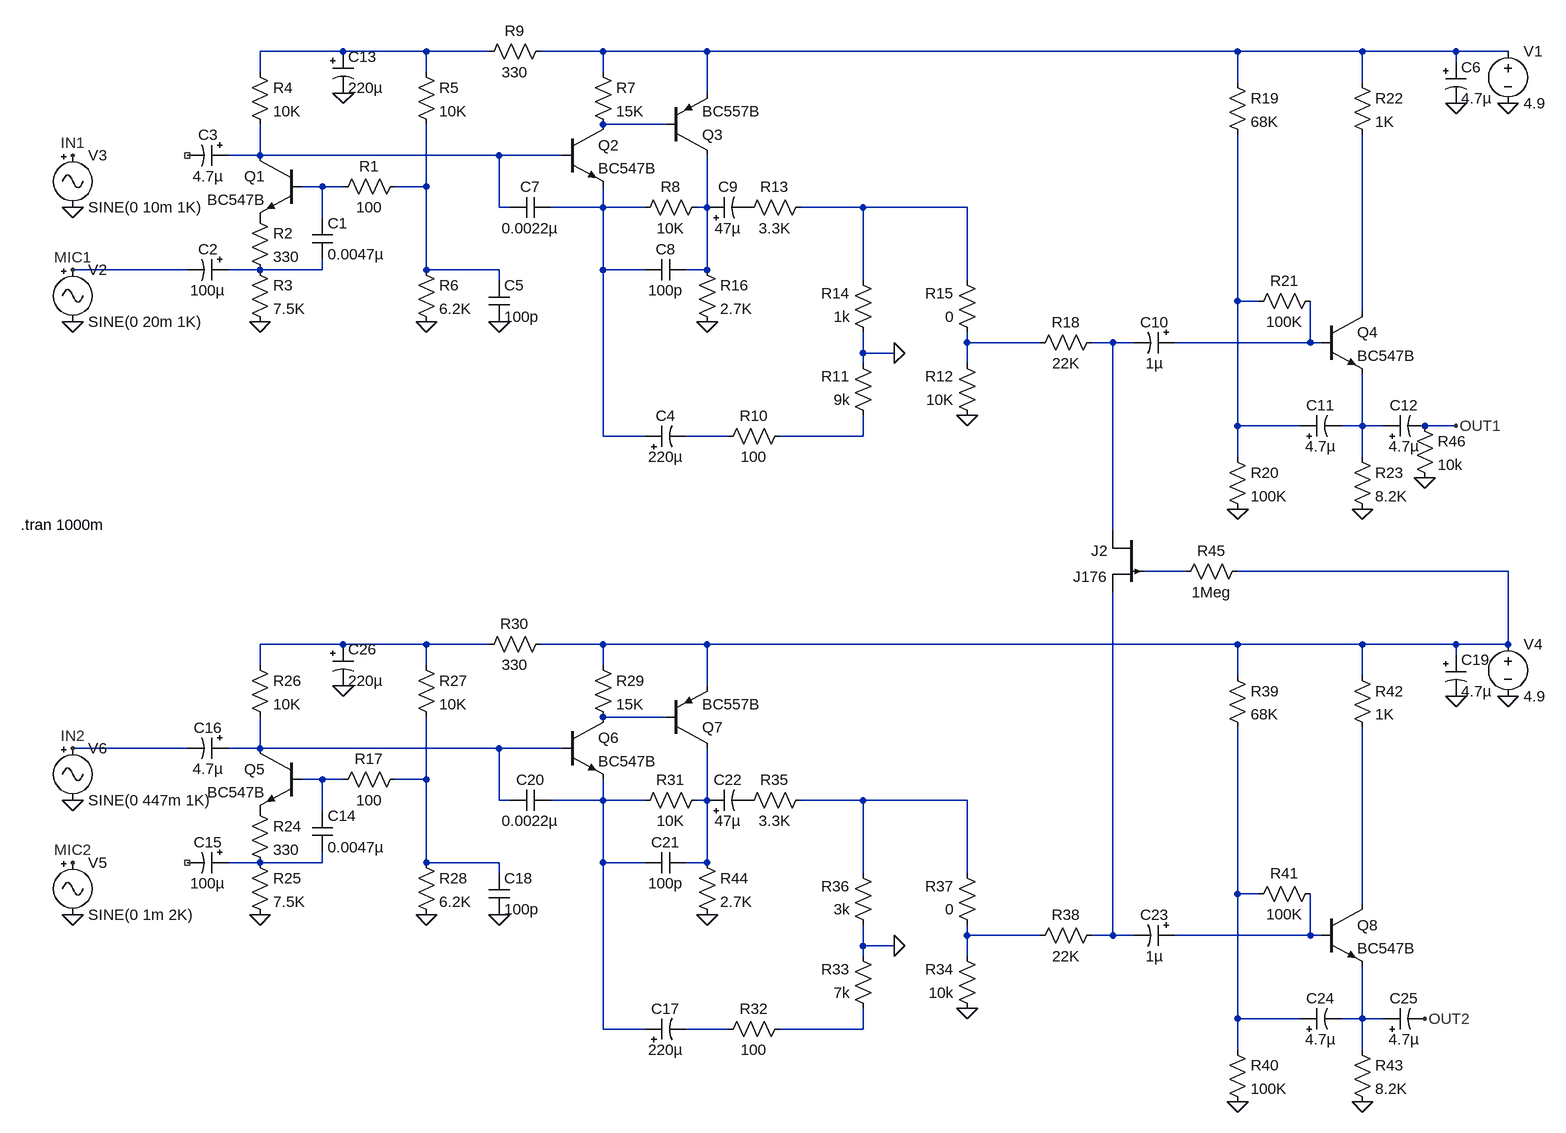
[diagram p0: schematic 1200_MIC.asc]
1200_MIC.asc, the LTspice schematic file:
Version 4
SHEET 1 2336 1624
WIRE 480 -32 352 -32
WIRE 608 -32 480 -32
WIRE 704 -32 608 -32
WIRE 880 -32 784 -32
WIRE 1040 -32 880 -32
WIRE 1856 -32 1040 -32
WIRE 2048 -32 1856 -32
WIRE 2192 -32 2048 -32
WIRE 2272 -32 2192 -32
WIRE 2192 -16 2192 -32
WIRE 352 0 352 -32
WIRE 608 0 608 -32
WIRE 880 0 880 -32
WIRE 1856 16 1856 -32
WIRE 2048 16 2048 -32
WIRE 1040 32 1040 -32
WIRE 976 80 880 80
WIRE 352 128 352 80
WIRE 352 128 304 128
WIRE 720 128 352 128
WIRE 816 128 720 128
WIRE 448 176 416 176
WIRE 480 176 448 176
WIRE 608 176 608 80
WIRE 608 176 560 176
WIRE 720 208 720 128
WIRE 736 208 720 208
WIRE 880 208 880 176
WIRE 880 208 800 208
WIRE 944 208 880 208
WIRE 1040 208 1040 128
WIRE 1040 208 1024 208
WIRE 1280 208 1184 208
WIRE 1440 208 1280 208
WIRE 448 224 448 176
WIRE 240 304 64 304
WIRE 352 304 304 304
WIRE 448 304 448 288
WIRE 448 304 352 304
WIRE 608 304 608 176
WIRE 720 304 608 304
WIRE 880 304 880 208
WIRE 944 304 880 304
WIRE 1040 304 1040 208
WIRE 1040 304 1008 304
WIRE 720 320 720 304
WIRE 1280 320 1280 208
WIRE 1440 320 1440 208
WIRE 1856 352 1856 96
WIRE 1888 352 1856 352
WIRE 2048 368 2048 96
WIRE 1440 416 1440 400
WIRE 1552 416 1440 416
WIRE 1664 416 1632 416
WIRE 1696 416 1664 416
WIRE 1968 416 1968 352
WIRE 1968 416 1760 416
WIRE 1984 416 1968 416
WIRE 1280 432 1280 400
WIRE 1328 432 1280 432
WIRE 1280 448 1280 432
WIRE 1440 448 1440 416
WIRE 1856 544 1856 352
WIRE 1952 544 1856 544
WIRE 2048 544 2048 464
WIRE 2048 544 2016 544
WIRE 2080 544 2048 544
WIRE 2192 544 2144 544
WIRE 880 560 880 304
WIRE 944 560 880 560
WIRE 1072 560 1008 560
WIRE 1280 560 1280 528
WIRE 1280 560 1152 560
WIRE 1856 592 1856 544
WIRE 2048 592 2048 544
WIRE 1664 704 1664 416
WIRE 1776 768 1712 768
WIRE 2272 768 1856 768
WIRE 480 880 352 880
WIRE 608 880 480 880
WIRE 704 880 608 880
WIRE 880 880 784 880
WIRE 1040 880 880 880
WIRE 1856 880 1040 880
WIRE 2048 880 1856 880
WIRE 2192 880 2048 880
WIRE 2272 880 2272 768
WIRE 2272 880 2192 880
WIRE 2192 896 2192 880
WIRE 352 912 352 880
WIRE 608 912 608 880
WIRE 880 912 880 880
WIRE 1856 928 1856 880
WIRE 2048 928 2048 880
WIRE 1040 944 1040 880
WIRE 976 992 880 992
WIRE 240 1040 64 1040
WIRE 352 1040 352 992
WIRE 352 1040 304 1040
WIRE 720 1040 352 1040
WIRE 816 1040 720 1040
WIRE 448 1088 416 1088
WIRE 480 1088 448 1088
WIRE 608 1088 608 992
WIRE 608 1088 560 1088
WIRE 720 1120 720 1040
WIRE 736 1120 720 1120
WIRE 880 1120 880 1088
WIRE 880 1120 800 1120
WIRE 944 1120 880 1120
WIRE 1040 1120 1040 1040
WIRE 1040 1120 1024 1120
WIRE 1280 1120 1184 1120
WIRE 1440 1120 1280 1120
WIRE 448 1136 448 1088
WIRE 352 1216 304 1216
WIRE 448 1216 448 1200
WIRE 448 1216 352 1216
WIRE 608 1216 608 1088
WIRE 720 1216 608 1216
WIRE 880 1216 880 1120
WIRE 944 1216 880 1216
WIRE 1040 1216 1040 1120
WIRE 1040 1216 1008 1216
WIRE 720 1232 720 1216
WIRE 1280 1232 1280 1120
WIRE 1440 1232 1440 1120
WIRE 1856 1264 1856 1008
WIRE 1888 1264 1856 1264
WIRE 2048 1280 2048 1008
WIRE 1440 1328 1440 1312
WIRE 1552 1328 1440 1328
WIRE 1664 1328 1664 800
WIRE 1664 1328 1632 1328
WIRE 1696 1328 1664 1328
WIRE 1968 1328 1968 1264
WIRE 1968 1328 1760 1328
WIRE 1984 1328 1968 1328
WIRE 1280 1344 1280 1312
WIRE 1328 1344 1280 1344
WIRE 1280 1360 1280 1344
WIRE 1440 1360 1440 1328
WIRE 1856 1456 1856 1264
WIRE 1952 1456 1856 1456
WIRE 2048 1456 2048 1376
WIRE 2048 1456 2016 1456
WIRE 2080 1456 2048 1456
WIRE 880 1472 880 1216
WIRE 944 1472 880 1472
WIRE 1072 1472 1008 1472
WIRE 1280 1472 1280 1440
WIRE 1280 1472 1152 1472
WIRE 1856 1504 1856 1456
WIRE 2048 1504 2048 1456
FLAG 352 384 0
FLAG 64 128 IN1
FLAG 64 304 MIC1
FLAG 480 32 0
FLAG 608 384 0
FLAG 720 384 0
FLAG 2272 48 0
FLAG 2192 48 0
FLAG 1328 432 0
FLAG 1440 528 0
FLAG 1856 672 0
FLAG 2048 672 0
FLAG 2192 544 OUT1
FLAG 64 384 0
FLAG 1040 384 0
FLAG 64 208 0
FLAG 352 1296 0
FLAG 64 1040 IN2
FLAG 64 1216 MIC2
FLAG 480 944 0
FLAG 608 1296 0
FLAG 720 1296 0
FLAG 2272 960 0
FLAG 2192 960 0
FLAG 1328 1344 0
FLAG 1440 1440 0
FLAG 1856 1584 0
FLAG 2048 1584 0
FLAG 2144 1456 OUT2
FLAG 64 1296 0
FLAG 1040 1296 0
FLAG 64 1120 0
FLAG 2144 624 0
SYMBOL npn 416 128 M0
SYMATTR InstName Q1
SYMATTR Value BC547B
SYMBOL res 576 160 R90
WINDOW 0 0 56 VBottom 2
WINDOW 3 32 56 VTop 2
SYMATTR InstName R1
SYMATTR Value 100
SYMATTR SpiceLine tol=1 pwr=0.1
SYMBOL cap 432 224 R0
SYMATTR InstName C1
SYMATTR Value 0.0047µ
SYMATTR SpiceLine V=25 Irms=192m Rser=1.19094 Lser=0 mfg="KEMET" pn="C0402C472K3RAC" type="X7R"
SYMBOL res 336 208 R0
SYMATTR InstName R2
SYMATTR Value 330
SYMATTR SpiceLine tol=1 pwr=0.1
SYMBOL res 336 288 R0
SYMATTR InstName R3
SYMATTR Value 7.5K
SYMATTR SpiceLine tol=1 pwr=0.1
SYMBOL polcap 304 288 R90
WINDOW 0 0 32 VBottom 2
WINDOW 3 32 32 VTop 2
SYMATTR InstName C2
SYMATTR Value 100µ
SYMATTR Description Capacitor
SYMATTR Type cap
SYMATTR SpiceLine V=6.3 Irms=175m Rser=0.65 Lser=0 mfg="Panasonic" pn="ECA0JFQ101" type="Al electrolytic"
SYMBOL polcap 304 112 R90
WINDOW 0 0 32 VBottom 2
WINDOW 3 32 32 VTop 2
SYMATTR InstName C3
SYMATTR Value 4.7µ
SYMATTR Description Capacitor
SYMATTR Type cap
SYMATTR SpiceLine V=25 Irms=24m Rser=5 Lser=0 mfg="Nichicon" pn="UPR1E4R7MAH" type="Al electrolytic"
SYMBOL res 336 -16 R0
SYMATTR InstName R4
SYMATTR Value 10K
SYMATTR SpiceLine tol=1 pwr=0.1
SYMBOL polcap 944 576 R270
WINDOW 0 32 32 VTop 2
WINDOW 3 0 32 VBottom 2
SYMATTR InstName C4
SYMATTR Value 220µ
SYMATTR Description Capacitor
SYMATTR Type cap
SYMATTR SpiceLine V=6.3 Irms=290m Rser=0.3 Lser=0 mfg="Panasonic" pn="ECA0JFQ221" type="Al electrolytic"
SYMBOL res 592 -16 R0
SYMATTR InstName R5
SYMATTR Value 10K
SYMATTR SpiceLine tol=1 pwr=0.1
SYMBOL res 592 288 R0
SYMATTR InstName R6
SYMATTR Value 6.2K
SYMATTR SpiceLine tol=1 pwr=0.1
SYMBOL cap 704 320 R0
SYMATTR InstName C5
SYMATTR Value 100p
SYMATTR SpiceLine V=6.3 Irms=728m Rser=0.14361 Lser=0
SYMBOL npn 816 80 R0
SYMATTR InstName Q2
SYMATTR Value BC547B
SYMBOL pnp 976 128 M180
SYMATTR InstName Q3
SYMATTR Value BC557B
SYMBOL res 864 -16 R0
SYMATTR InstName R7
SYMATTR Value 15K
SYMATTR SpiceLine tol=1 pwr=0.1
SYMBOL res 800 -48 R90
WINDOW 0 0 56 VBottom 2
WINDOW 3 32 56 VTop 2
SYMATTR InstName R9
SYMATTR Value 330
SYMATTR SpiceLine tol=1 pwr=0.1
SYMBOL voltage 2272 -48 R0
WINDOW 123 0 0 Left 0
WINDOW 39 0 0 Left 0
SYMATTR InstName V1
SYMATTR Value 4.9
SYMBOL polcap 2176 -16 R0
WINDOW 3 24 56 Left 2
SYMATTR Value 4.7µ
SYMATTR InstName C6
SYMATTR Description Capacitor
SYMATTR Type cap
SYMATTR SpiceLine V=25 Irms=24m Rser=5 Lser=0 mfg="Nichicon" pn="UPR1E4R7MAH" type="Al electrolytic"
SYMBOL res 1040 192 R90
WINDOW 0 0 56 VBottom 2
WINDOW 3 32 56 VTop 2
SYMATTR InstName R8
SYMATTR Value 10K
SYMATTR SpiceLine tol=1 pwr=0.1
SYMBOL cap 800 192 R90
WINDOW 0 0 32 VBottom 2
WINDOW 3 32 32 VTop 2
SYMATTR InstName C7
SYMATTR Value 0.0022µ
SYMATTR SpiceLine V=6.3 Irms=56.2m Rser=1.80898 Lser=0 mfg="KEMET" pn="C0402C222K9RAC" type="X7R"
SYMBOL cap 1008 288 R90
WINDOW 0 0 32 VBottom 2
WINDOW 3 32 32 VTop 2
SYMATTR InstName C8
SYMATTR Value 100p
SYMATTR SpiceLine V=25 Irms=0 Rser=0 Lser=0 mfg="Murata" pn="GRM0335C1E101JA01" type="C0G"
SYMBOL res 1168 544 R90
WINDOW 0 0 56 VBottom 2
WINDOW 3 32 56 VTop 2
SYMATTR InstName R10
SYMATTR Value 100
SYMATTR SpiceLine tol=1 pwr=0.1
SYMBOL res 1296 544 R180
WINDOW 0 36 76 Left 2
WINDOW 3 36 40 Left 2
SYMATTR InstName R11
SYMATTR Value 9k
SYMBOL res 1456 544 R180
WINDOW 0 36 76 Left 2
WINDOW 3 36 40 Left 2
SYMATTR InstName R12
SYMATTR Value 10K
SYMBOL res 1200 192 R90
WINDOW 0 0 56 VBottom 2
WINDOW 3 32 56 VTop 2
SYMATTR InstName R13
SYMATTR Value 3.3K
SYMATTR SpiceLine tol=1 pwr=0.1
SYMBOL polcap 1040 224 R270
WINDOW 0 32 32 VTop 2
WINDOW 3 0 32 VBottom 2
SYMATTR InstName C9
SYMATTR Value 47µ
SYMATTR Description Capacitor
SYMATTR Type cap
SYMATTR SpiceLine V=6.3 Irms=0 Rser=1.1 Lser=0 mfg="AVX" pn="TAJD476M006" type="Tantalum"
SYMBOL res 1296 416 R180
WINDOW 0 36 76 Left 2
WINDOW 3 36 40 Left 2
SYMATTR InstName R14
SYMATTR Value 1k
SYMBOL res 1456 416 R180
WINDOW 0 36 76 Left 2
WINDOW 3 36 40 Left 2
SYMATTR InstName R15
SYMATTR Value 0
SYMBOL res 1648 400 R90
WINDOW 0 0 56 VBottom 2
WINDOW 3 32 56 VTop 2
SYMATTR InstName R18
SYMATTR Value 22K
SYMATTR SpiceLine tol=1 pwr=0.1
SYMBOL polcap 1760 400 R90
WINDOW 0 0 32 VBottom 2
WINDOW 3 32 32 VTop 2
SYMATTR InstName C10
SYMATTR Value 1µ
SYMATTR Description Capacitor
SYMATTR Type cap
SYMATTR SpiceLine V=50 Irms=12m Rser=22 Lser=0 mfg="Nichicon" pn="UPR1H010MAH" type="Al electrolytic"
SYMBOL npn 1984 368 R0
SYMATTR InstName Q4
SYMATTR Value BC547B
SYMBOL res 1840 0 R0
SYMATTR InstName R19
SYMATTR Value 68K
SYMATTR SpiceLine tol=1 pwr=0.1
SYMBOL res 1840 576 R0
SYMATTR InstName R20
SYMATTR Value 100K
SYMATTR SpiceLine tol=1 pwr=0.1
SYMBOL polcap 1952 560 R270
WINDOW 0 32 32 VTop 2
WINDOW 3 0 32 VBottom 2
SYMATTR InstName C11
SYMATTR Value 4.7µ
SYMATTR Description Capacitor
SYMATTR Type cap
SYMATTR SpiceLine V=25 Irms=24m Rser=5 Lser=0 mfg="Nichicon" pn="UPR1E4R7MAH" type="Al electrolytic"
SYMBOL polcap 2080 560 R270
WINDOW 0 32 32 VTop 2
WINDOW 3 0 32 VBottom 2
SYMATTR InstName C12
SYMATTR Value 4.7µ
SYMATTR Description Capacitor
SYMATTR Type cap
SYMATTR SpiceLine V=25 Irms=24m Rser=5 Lser=0 mfg="Nichicon" pn="UPR1E4R7MAH" type="Al electrolytic"
SYMBOL res 1984 336 R90
WINDOW 0 0 56 VBottom 2
WINDOW 3 32 56 VTop 2
SYMATTR InstName R21
SYMATTR Value 100K
SYMATTR SpiceLine tol=1 pwr=0.1
SYMBOL res 2032 0 R0
SYMATTR InstName R22
SYMATTR Value 1K
SYMATTR SpiceLine tol=1 pwr=0.1
SYMBOL res 2032 576 R0
SYMATTR InstName R23
SYMATTR Value 8.2K
SYMATTR SpiceLine tol=1 pwr=0.1
SYMBOL Misc\\signal 64 288 R0
WINDOW 123 0 0 Left 0
WINDOW 39 0 0 Left 0
SYMATTR InstName V2
SYMATTR Value SINE(0 20m 1K)
SYMBOL polcap 464 -32 R0
SYMATTR InstName C13
SYMATTR Value 220µ
SYMATTR Description Capacitor
SYMATTR Type cap
SYMATTR SpiceLine V=6.3 Irms=290m Rser=0.3 Lser=0 mfg="Panasonic" pn="ECA0JFQ221" type="Al electrolytic"
SYMBOL res 1024 288 R0
SYMATTR InstName R16
SYMATTR Value 2.7K
SYMATTR SpiceLine tol=1 pwr=0.1
SYMBOL Misc\\signal 64 112 R0
WINDOW 123 0 0 Left 0
WINDOW 39 0 0 Left 0
SYMATTR InstName V3
SYMATTR Value SINE(0 10m 1K)
SYMBOL npn 416 1040 M0
SYMATTR InstName Q5
SYMATTR Value BC547B
SYMBOL res 576 1072 R90
WINDOW 0 0 56 VBottom 2
WINDOW 3 32 56 VTop 2
SYMATTR InstName R17
SYMATTR Value 100
SYMATTR SpiceLine tol=1 pwr=0.1
SYMBOL cap 432 1136 R0
SYMATTR InstName C14
SYMATTR Value 0.0047µ
SYMATTR SpiceLine V=25 Irms=192m Rser=1.19094 Lser=0 mfg="KEMET" pn="C0402C472K3RAC" type="X7R"
SYMBOL res 336 1120 R0
SYMATTR InstName R24
SYMATTR Value 330
SYMATTR SpiceLine tol=1 pwr=0.1
SYMBOL res 336 1200 R0
SYMATTR InstName R25
SYMATTR Value 7.5K
SYMATTR SpiceLine tol=1 pwr=0.1
SYMBOL polcap 304 1200 R90
WINDOW 0 0 32 VBottom 2
WINDOW 3 32 32 VTop 2
SYMATTR InstName C15
SYMATTR Value 100µ
SYMATTR Description Capacitor
SYMATTR Type cap
SYMATTR SpiceLine V=6.3 Irms=175m Rser=0.65 Lser=0 mfg="Panasonic" pn="ECA0JFQ101" type="Al electrolytic"
SYMBOL polcap 304 1024 R90
WINDOW 0 0 32 VBottom 2
WINDOW 3 32 32 VTop 2
SYMATTR InstName C16
SYMATTR Value 4.7µ
SYMATTR Description Capacitor
SYMATTR Type cap
SYMATTR SpiceLine V=25 Irms=24m Rser=5 Lser=0 mfg="Nichicon" pn="UPR1E4R7MAH" type="Al electrolytic"
SYMBOL res 336 896 R0
SYMATTR InstName R26
SYMATTR Value 10K
SYMATTR SpiceLine tol=1 pwr=0.1
SYMBOL polcap 944 1488 R270
WINDOW 0 32 32 VTop 2
WINDOW 3 0 32 VBottom 2
SYMATTR InstName C17
SYMATTR Value 220µ
SYMATTR Description Capacitor
SYMATTR Type cap
SYMATTR SpiceLine V=6.3 Irms=290m Rser=0.3 Lser=0 mfg="Panasonic" pn="ECA0JFQ221" type="Al electrolytic"
SYMBOL res 592 896 R0
SYMATTR InstName R27
SYMATTR Value 10K
SYMATTR SpiceLine tol=1 pwr=0.1
SYMBOL res 592 1200 R0
SYMATTR InstName R28
SYMATTR Value 6.2K
SYMATTR SpiceLine tol=1 pwr=0.1
SYMBOL cap 704 1232 R0
SYMATTR InstName C18
SYMATTR Value 100p
SYMATTR SpiceLine V=6.3 Irms=728m Rser=0.14361 Lser=0
SYMBOL npn 816 992 R0
SYMATTR InstName Q6
SYMATTR Value BC547B
SYMBOL pnp 976 1040 M180
SYMATTR InstName Q7
SYMATTR Value BC557B
SYMBOL res 864 896 R0
SYMATTR InstName R29
SYMATTR Value 15K
SYMATTR SpiceLine tol=1 pwr=0.1
SYMBOL res 800 864 R90
WINDOW 0 0 56 VBottom 2
WINDOW 3 32 56 VTop 2
SYMATTR InstName R30
SYMATTR Value 330
SYMATTR SpiceLine tol=1 pwr=0.1
SYMBOL voltage 2272 864 R0
WINDOW 123 0 0 Left 0
WINDOW 39 0 0 Left 0
SYMATTR InstName V4
SYMATTR Value 4.9
SYMBOL polcap 2176 896 R0
WINDOW 3 24 56 Left 2
SYMATTR Value 4.7µ
SYMATTR InstName C19
SYMATTR Description Capacitor
SYMATTR Type cap
SYMATTR SpiceLine V=25 Irms=24m Rser=5 Lser=0 mfg="Nichicon" pn="UPR1E4R7MAH" type="Al electrolytic"
SYMBOL res 1040 1104 R90
WINDOW 0 0 56 VBottom 2
WINDOW 3 32 56 VTop 2
SYMATTR InstName R31
SYMATTR Value 10K
SYMATTR SpiceLine tol=1 pwr=0.1
SYMBOL cap 800 1104 R90
WINDOW 0 0 32 VBottom 2
WINDOW 3 32 32 VTop 2
SYMATTR InstName C20
SYMATTR Value 0.0022µ
SYMATTR SpiceLine V=6.3 Irms=56.2m Rser=1.80898 Lser=0 mfg="KEMET" pn="C0402C222K9RAC" type="X7R"
SYMBOL cap 1008 1200 R90
WINDOW 0 0 32 VBottom 2
WINDOW 3 32 32 VTop 2
SYMATTR InstName C21
SYMATTR Value 100p
SYMATTR SpiceLine V=25 Irms=0 Rser=0 Lser=0 mfg="Murata" pn="GRM0335C1E101JA01" type="C0G"
SYMBOL res 1168 1456 R90
WINDOW 0 0 56 VBottom 2
WINDOW 3 32 56 VTop 2
SYMATTR InstName R32
SYMATTR Value 100
SYMATTR SpiceLine tol=1 pwr=0.1
SYMBOL res 1296 1456 R180
WINDOW 0 36 76 Left 2
WINDOW 3 36 40 Left 2
SYMATTR InstName R33
SYMATTR Value 7k
SYMBOL res 1456 1456 R180
WINDOW 0 36 76 Left 2
WINDOW 3 36 40 Left 2
SYMATTR InstName R34
SYMATTR Value 10k
SYMBOL res 1200 1104 R90
WINDOW 0 0 56 VBottom 2
WINDOW 3 32 56 VTop 2
SYMATTR InstName R35
SYMATTR Value 3.3K
SYMATTR SpiceLine tol=1 pwr=0.1
SYMBOL polcap 1040 1136 R270
WINDOW 0 32 32 VTop 2
WINDOW 3 0 32 VBottom 2
SYMATTR InstName C22
SYMATTR Value 47µ
SYMATTR Description Capacitor
SYMATTR Type cap
SYMATTR SpiceLine V=6.3 Irms=0 Rser=1.1 Lser=0 mfg="AVX" pn="TAJD476M006" type="Tantalum"
SYMBOL res 1296 1328 R180
WINDOW 0 36 76 Left 2
WINDOW 3 36 40 Left 2
SYMATTR InstName R36
SYMATTR Value 3k
SYMBOL res 1456 1328 R180
WINDOW 0 36 76 Left 2
WINDOW 3 36 40 Left 2
SYMATTR InstName R37
SYMATTR Value 0
SYMBOL res 1648 1312 R90
WINDOW 0 0 56 VBottom 2
WINDOW 3 32 56 VTop 2
SYMATTR InstName R38
SYMATTR Value 22K
SYMATTR SpiceLine tol=1 pwr=0.1
SYMBOL polcap 1760 1312 R90
WINDOW 0 0 32 VBottom 2
WINDOW 3 32 32 VTop 2
SYMATTR InstName C23
SYMATTR Value 1µ
SYMATTR Description Capacitor
SYMATTR Type cap
SYMATTR SpiceLine V=50 Irms=12m Rser=22 Lser=0 mfg="Nichicon" pn="UPR1H010MAH" type="Al electrolytic"
SYMBOL npn 1984 1280 R0
SYMATTR InstName Q8
SYMATTR Value BC547B
SYMBOL res 1840 912 R0
SYMATTR InstName R39
SYMATTR Value 68K
SYMATTR SpiceLine tol=1 pwr=0.1
SYMBOL res 1840 1488 R0
SYMATTR InstName R40
SYMATTR Value 100K
SYMATTR SpiceLine tol=1 pwr=0.1
SYMBOL polcap 1952 1472 R270
WINDOW 0 32 32 VTop 2
WINDOW 3 0 32 VBottom 2
SYMATTR InstName C24
SYMATTR Value 4.7µ
SYMATTR Description Capacitor
SYMATTR Type cap
SYMATTR SpiceLine V=25 Irms=24m Rser=5 Lser=0 mfg="Nichicon" pn="UPR1E4R7MAH" type="Al electrolytic"
SYMBOL polcap 2080 1472 R270
WINDOW 0 32 32 VTop 2
WINDOW 3 0 32 VBottom 2
SYMATTR InstName C25
SYMATTR Value 4.7µ
SYMATTR Description Capacitor
SYMATTR Type cap
SYMATTR SpiceLine V=25 Irms=24m Rser=5 Lser=0 mfg="Nichicon" pn="UPR1E4R7MAH" type="Al electrolytic"
SYMBOL res 1984 1248 R90
WINDOW 0 0 56 VBottom 2
WINDOW 3 32 56 VTop 2
SYMATTR InstName R41
SYMATTR Value 100K
SYMATTR SpiceLine tol=1 pwr=0.1
SYMBOL res 2032 912 R0
SYMATTR InstName R42
SYMATTR Value 1K
SYMATTR SpiceLine tol=1 pwr=0.1
SYMBOL res 2032 1488 R0
SYMATTR InstName R43
SYMATTR Value 8.2K
SYMATTR SpiceLine tol=1 pwr=0.1
SYMBOL Misc\\signal 64 1200 R0
WINDOW 123 0 0 Left 0
WINDOW 39 0 0 Left 0
SYMATTR InstName V5
SYMATTR Value SINE(0 1m 2K)
SYMBOL polcap 464 880 R0
SYMATTR InstName C26
SYMATTR Value 220µ
SYMATTR Description Capacitor
SYMATTR Type cap
SYMATTR SpiceLine V=6.3 Irms=290m Rser=0.3 Lser=0 mfg="Panasonic" pn="ECA0JFQ221" type="Al electrolytic"
SYMBOL res 1024 1200 R0
SYMATTR InstName R44
SYMATTR Value 2.7K
SYMATTR SpiceLine tol=1 pwr=0.1
SYMBOL Misc\\signal 64 1024 R0
WINDOW 123 0 0 Left 0
WINDOW 39 0 0 Left 0
SYMATTR InstName V6
SYMATTR Value SINE(0 447m 1K)
SYMBOL pjf 1712 704 M0
SYMATTR InstName J2
SYMATTR Value J176
SYMBOL res 1872 752 R90
WINDOW 0 0 56 VBottom 2
WINDOW 3 32 56 VTop 2
SYMATTR InstName R45
SYMATTR Value 1Meg
SYMATTR SpiceLine tol=1 pwr=0.1
SYMBOL res 2128 528 R0
SYMATTR InstName R46
SYMATTR Value 10k
TEXT -16 696 Left 2 !.tran 1000m

The netlist it stands for:
* 1200_MIC.asc
Q1 N004 N005 P001 0 BC547B
R1 N006 N005 100 tol=1 pwr=0.1
C1 N005 N010 0.0047µ V=25 Irms=192m Rser=1.19094 Lser=0 mfg="KEMET" pn="C0402C472K3RAC" type="X7R"
R2 P001 N010 330 tol=1 pwr=0.1
R3 N010 0 7.5K tol=1 pwr=0.1
C2 N010 MIC1 100µ V=6.3 Irms=175m Rser=0.65 Lser=0 mfg="Panasonic" pn="ECA0JFQ101" type="Al electrolytic"
C3 N004 NC_01 4.7µ V=25 Irms=24m Rser=5 Lser=0 mfg="Nichicon" pn="UPR1E4R7MAH" type="Al electrolytic"
R4 N001 N004 10K tol=1 pwr=0.1
C4 N007 N017 220µ V=6.3 Irms=290m Rser=0.3 Lser=0 mfg="Panasonic" pn="ECA0JFQ221" type="Al electrolytic"
R5 N001 N006 10K tol=1 pwr=0.1
R6 N006 0 6.2K tol=1 pwr=0.1
C5 N006 0 100p V=6.3 Irms=728m Rser=0.14361 Lser=0
Q2 N003 N004 N007 0 BC547B
Q3 N008 N003 N002 0 BC557B
R7 N002 N003 15K tol=1 pwr=0.1
R9 N002 N001 330 tol=1 pwr=0.1
V1 N002 0 4.9
C6 N002 0 4.7µ V=25 Irms=24m Rser=5 Lser=0 mfg="Nichicon" pn="UPR1E4R7MAH" type="Al electrolytic"
R8 N008 N007 10K tol=1 pwr=0.1
C7 N007 N004 0.0022µ V=6.3 Irms=56.2m Rser=1.80898 Lser=0 mfg="KEMET" pn="C0402C222K9RAC" type="X7R"
C8 N008 N007 100p V=25 Irms=0 Rser=0 Lser=0 mfg="Murata" pn="GRM0335C1E101JA01" type="C0G"
R10 N018 N017 100 tol=1 pwr=0.1
R11 N018 0 9k
R12 0 N013 10K
R13 N009 P002 3.3K tol=1 pwr=0.1
C9 N008 P002 47µ V=6.3 Irms=0 Rser=1.1 Lser=0 mfg="AVX" pn="TAJD476M006" type="Tantalum"
R14 0 N009 1k
R15 N013 N009 0
R18 N014 N013 22K tol=1 pwr=0.1
C10 N015 N014 1µ V=50 Irms=12m Rser=22 Lser=0 mfg="Nichicon" pn="UPR1H010MAH" type="Al electrolytic"
Q4 N012 N015 N016 0 BC547B
R19 N002 N011 68K tol=1 pwr=0.1
R20 N011 0 100K tol=1 pwr=0.1
C11 N011 N016 4.7µ V=25 Irms=24m Rser=5 Lser=0 mfg="Nichicon" pn="UPR1E4R7MAH" type="Al electrolytic"
C12 N016 OUT1 4.7µ V=25 Irms=24m Rser=5 Lser=0 mfg="Nichicon" pn="UPR1E4R7MAH" type="Al electrolytic"
R21 N015 N011 100K tol=1 pwr=0.1
R22 N002 N012 1K tol=1 pwr=0.1
R23 N016 0 8.2K tol=1 pwr=0.1
V2 MIC1 0 SINE(0 20m 1K)
C13 N001 0 220µ V=6.3 Irms=290m Rser=0.3 Lser=0 mfg="Panasonic" pn="ECA0JFQ221" type="Al electrolytic"
R16 N008 0 2.7K tol=1 pwr=0.1
V3 IN1 0 SINE(0 10m 1K)
Q5 N023 N024 P003 0 BC547B
R17 N025 N024 100 tol=1 pwr=0.1
C14 N024 N029 0.0047µ V=25 Irms=192m Rser=1.19094 Lser=0 mfg="KEMET" pn="C0402C472K3RAC" type="X7R"
R24 P003 N029 330 tol=1 pwr=0.1
R25 N029 0 7.5K tol=1 pwr=0.1
C15 N029 NC_02 100µ V=6.3 Irms=175m Rser=0.65 Lser=0 mfg="Panasonic" pn="ECA0JFQ101" type="Al electrolytic"
C16 N023 IN2 4.7µ V=25 Irms=24m Rser=5 Lser=0 mfg="Nichicon" pn="UPR1E4R7MAH" type="Al electrolytic"
R26 N021 N023 10K tol=1 pwr=0.1
C17 N026 N036 220µ V=6.3 Irms=290m Rser=0.3 Lser=0 mfg="Panasonic" pn="ECA0JFQ221" type="Al electrolytic"
R27 N021 N025 10K tol=1 pwr=0.1
R28 N025 0 6.2K tol=1 pwr=0.1
C18 N025 0 100p V=6.3 Irms=728m Rser=0.14361 Lser=0
Q6 N022 N023 N026 0 BC547B
Q7 N027 N022 N020 0 BC557B
R29 N020 N022 15K tol=1 pwr=0.1
R30 N020 N021 330 tol=1 pwr=0.1
V4 N020 0 4.9
C19 N020 0 4.7µ V=25 Irms=24m Rser=5 Lser=0 mfg="Nichicon" pn="UPR1E4R7MAH" type="Al electrolytic"
R31 N027 N026 10K tol=1 pwr=0.1
C20 N026 N023 0.0022µ V=6.3 Irms=56.2m Rser=1.80898 Lser=0 mfg="KEMET" pn="C0402C222K9RAC" type="X7R"
C21 N027 N026 100p V=25 Irms=0 Rser=0 Lser=0 mfg="Murata" pn="GRM0335C1E101JA01" type="C0G"
R32 N037 N036 100 tol=1 pwr=0.1
R33 N037 0 7k
R34 0 N032 10k
R35 N028 P004 3.3K tol=1 pwr=0.1
C22 N027 P004 47µ V=6.3 Irms=0 Rser=1.1 Lser=0 mfg="AVX" pn="TAJD476M006" type="Tantalum"
R36 0 N028 3k
R37 N032 N028 0
R38 N033 N032 22K tol=1 pwr=0.1
C23 N034 N033 1µ V=50 Irms=12m Rser=22 Lser=0 mfg="Nichicon" pn="UPR1H010MAH" type="Al electrolytic"
Q8 N031 N034 N035 0 BC547B
R39 N020 N030 68K tol=1 pwr=0.1
R40 N030 0 100K tol=1 pwr=0.1
C24 N030 N035 4.7µ V=25 Irms=24m Rser=5 Lser=0 mfg="Nichicon" pn="UPR1E4R7MAH" type="Al electrolytic"
C25 N035 OUT2 4.7µ V=25 Irms=24m Rser=5 Lser=0 mfg="Nichicon" pn="UPR1E4R7MAH" type="Al electrolytic"
R41 N034 N030 100K tol=1 pwr=0.1
R42 N020 N031 1K tol=1 pwr=0.1
R43 N035 0 8.2K tol=1 pwr=0.1
V5 MIC2 0 SINE(0 1m 2K)
C26 N021 0 220µ V=6.3 Irms=290m Rser=0.3 Lser=0 mfg="Panasonic" pn="ECA0JFQ221" type="Al electrolytic"
R44 N027 0 2.7K tol=1 pwr=0.1
V6 IN2 0 SINE(0 447m 1K)
J2 N014 N019 N033 J176
R45 N020 N019 1Meg tol=1 pwr=0.1
R46 OUT1 0 10k
.model NPN NPN
.model PNP PNP
.lib standard.bjt
.model NJF NJF
.model PJF PJF
.lib standard.jft
.tran 1000m
.backanno
.end